# Altium schematic sheet HVManagerTop.SchDoc
size A
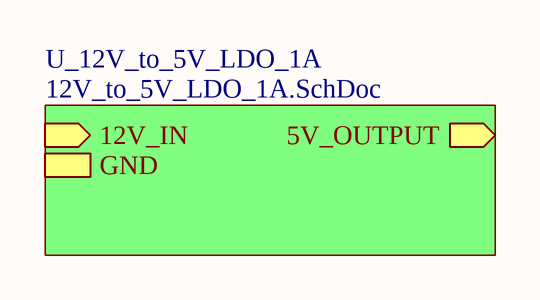
[diagram p0: HVManagerTop.SchDoc]

## Sub-sheets
U_12V_to_5V_LDO_1A = 12V_to_5V_LDO_1A.SchDoc: 12V_IN (in), 5V_OUTPUT (out), GND